# EAGLE design ldo-to-sps-patch (EAGLE 6.5.0)
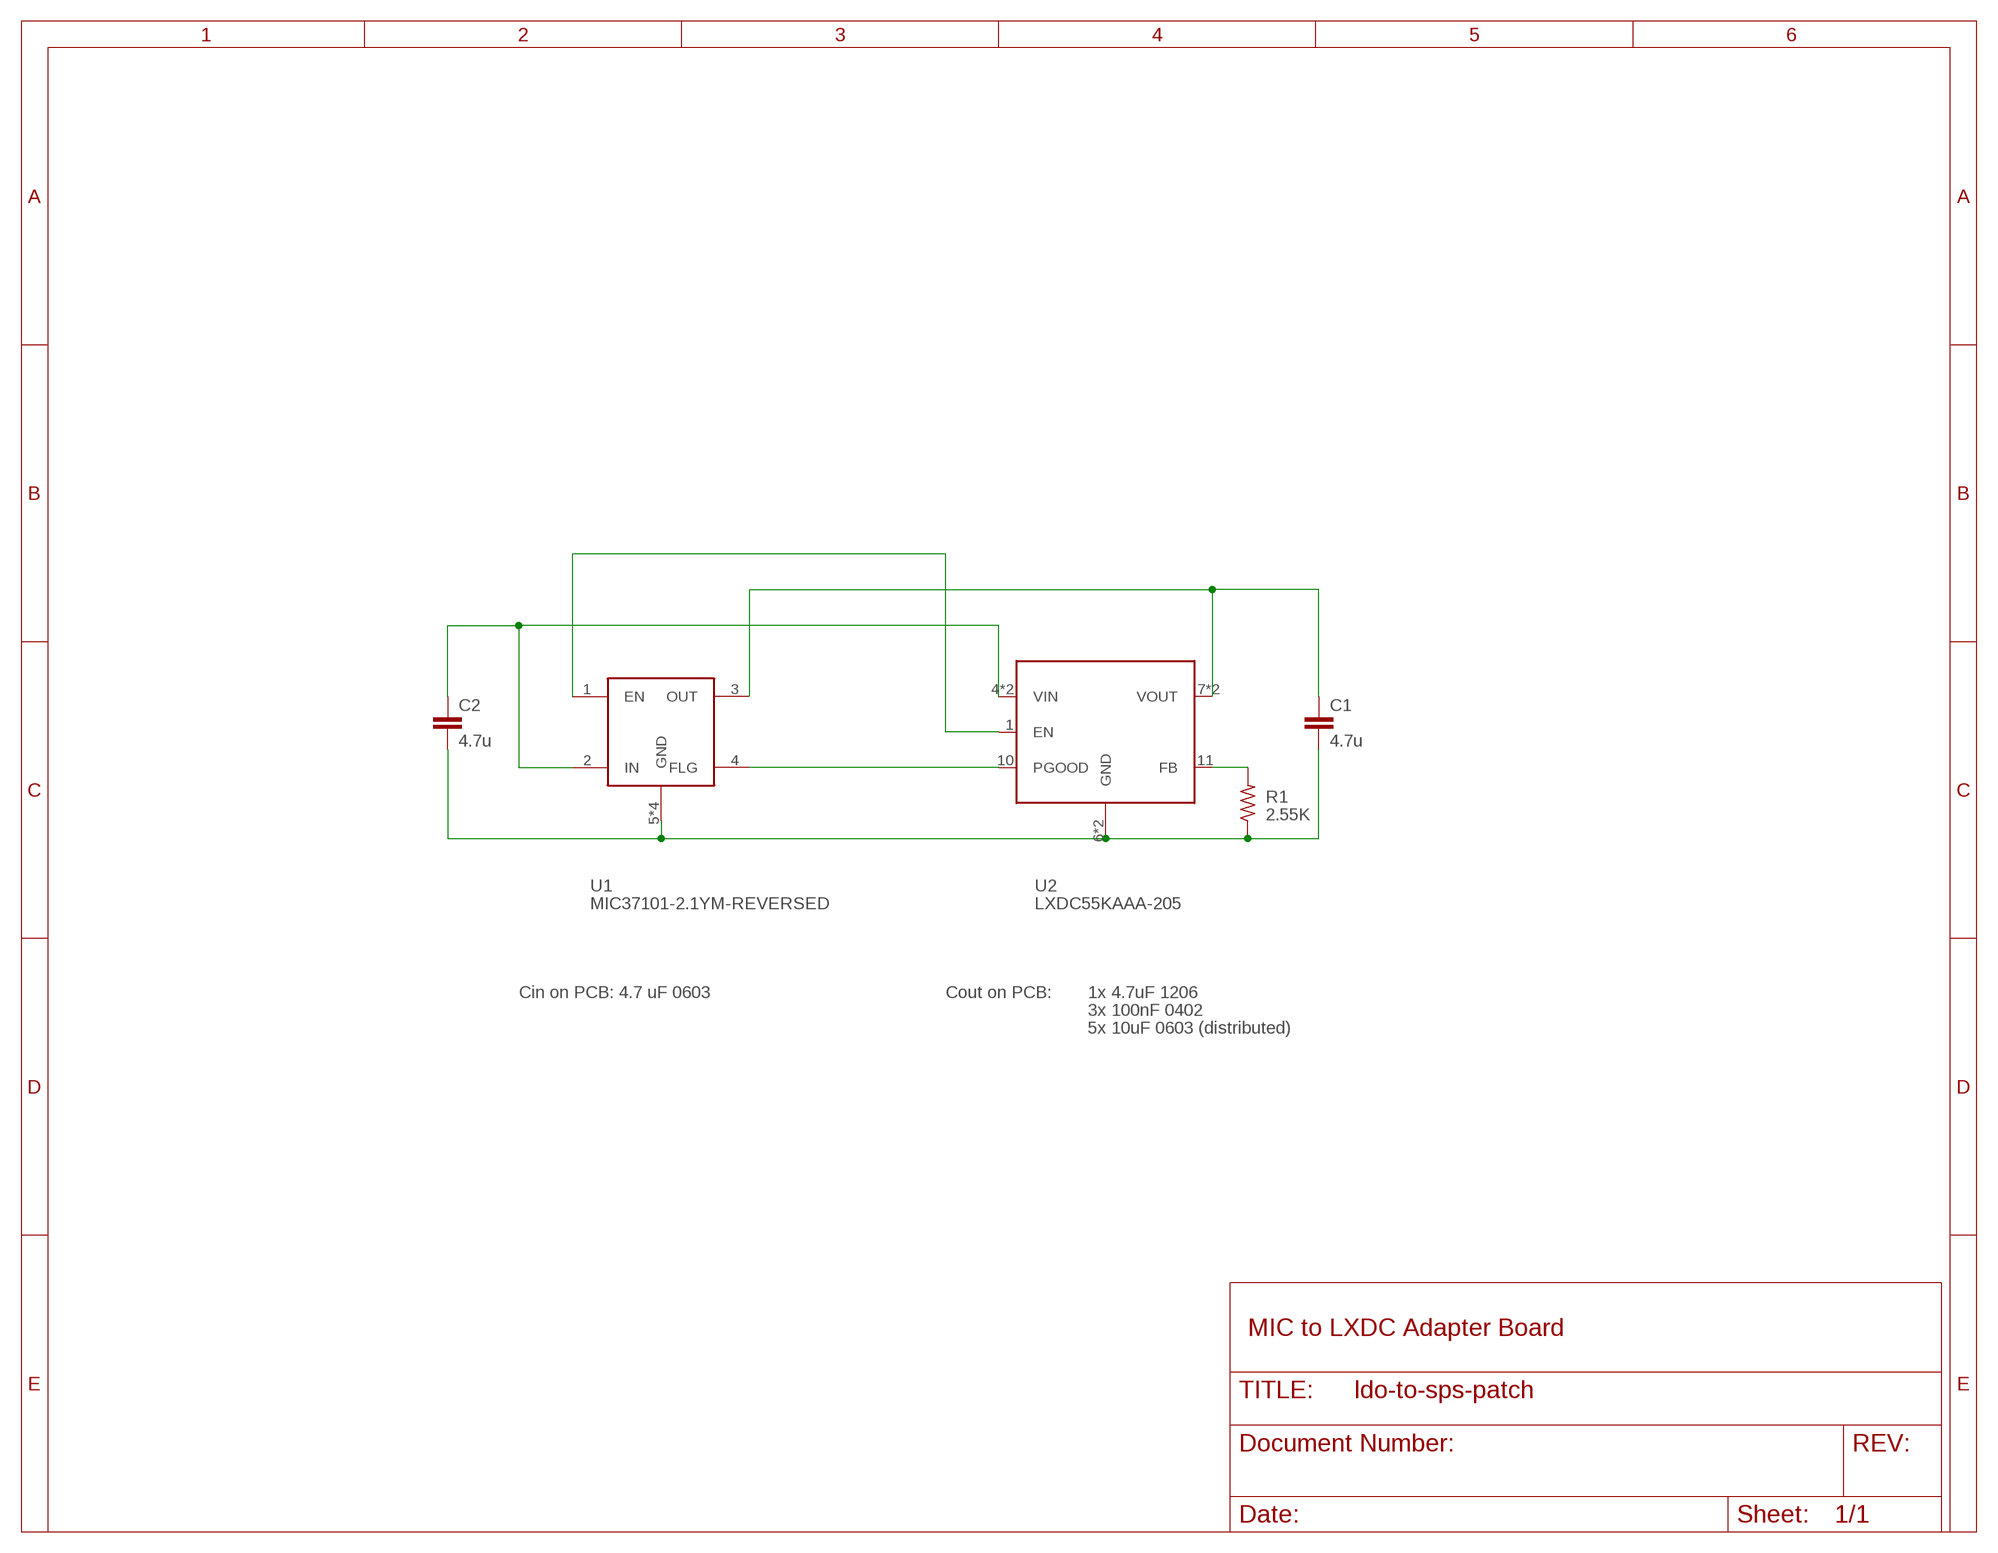
[diagram p0: schematic, sheet 1]

## Parts
C1  4.7u  C-EU0402-B-NOSILK  [0402-B-NOSILK]
C2  4.7u  C-EU0402-B-NOSILK  [0402-B-NOSILK]
R1  2.55K  R-US_0402-B-NOSILK  [0402-B-NOSILK]
U1  MIC37101-2.1YM-REVERSED  [SOIC-8-REVERSED]
U2  LXDC55KAAA-205  [LXDC55KAAA-205]

## Nets
EN: U1.1(EN) U2.1(EN)
FB: R1.2 U2.11(FB)
GND: C1.2 C2.2 R1.1 U1.5(GND) U1.6(GND) U1.7(GND) U1.8(GND) U2.6(GND) U2.12(GND)
PGOOD: U1.4(FLG) U2.10(PGOOD)
VIN: C2.1 U1.2(IN) U2.4(VIN) U2.5(VIN)
VOUT: C1.1 U1.3(OUT) U2.7(VOUT) U2.8(VOUT)

## Notes on the sheet
- Cin on PCB: 4.7 uF 0603 | Cout on PCB: | 1x 4.7uF 1206
- 3x 100nF 0402
- 5x 10uF 0603 (distributed)
- MIC to LXDC Adapter Board

## Library data of the parts
C1 C2 = rcl_custom:C-EU: CAPACITOR, European symbol
R1 = rcl_custom:R-US_: RESISTOR, American symbol
U1 = MIC37100:MIC37101-2.1YM-REVERSED
U2 = lxdc55kaaa-205:LXDC55KAAA-205

## Board
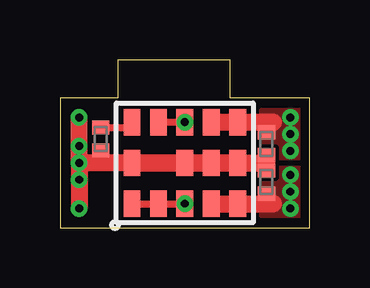
[diagram p1: board, top side]
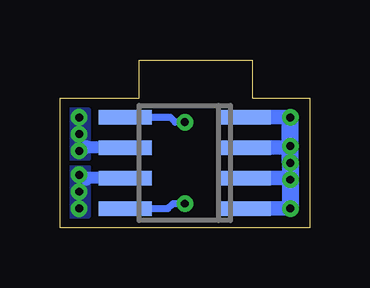
[diagram p2: board, bottom side, seen from below]

Size 10.4 x 7 mm. Coordinates in mm from the lower left corner, seen from the top.
Outline: 0,0 10.4,0 10.4,5.4 7.1,5.4 7.1,7 2.4,7 2.4,5.4 0,5.4 0,0
Copper layers (1*16): Top 0.0356mm / dielectric 1.5011mm / Bottom 0.0356mm
Design rules "osh-park-2layer *": minimum track width 6mil, minimum drill 13mil, track to track 6mil, track to pad 6mil, pad to pad 6mil, via to via 6mil, smd to smd 6mil, copper to edge 15mil, drill to drill 6mil, minimum pad ring 7mil, minimum via ring 7mil, stop-mask expansion 3mil, vias tented up to drill 16mil, thermal gap 10mil

### Footprints (pad centres in the part's own frame; a part is rotated, then mirrored left to right if it is on the bottom)
0402-B-NOSILK = smd 0.59 x 0.72: 1 -0.48,0; 2 0.48,0
SOIC-8-REVERSED = smd 0.6 x 2.2: 1 -1.905,2.48; 2 -0.635,2.48; 3 0.635,2.48; 4 1.905,2.48; 5 1.905,-2.48; 6 0.635,-2.48; 7 -0.635,-2.48; 8 -1.905,-2.48
LXDC55KAAA-205 = smd 0.7 x 1.1: 1 2.2,1.7; 2 1.1,1.7; 3 0,1.7; 4 -1.1,1.7; 5 -2.2,1.7; 6 -2.2,0; 7 -2.2,-1.7; 8 -1.1,-1.7; 9 0,-1.7; 10 1.1,-1.7; 11 2.2,-1.7; 12 2.2,0; 13 0,0; 14 -1.1,0

### Placement (x,y rotation side)
C1  8.6,3.5 270 top
C2  8.6,1.9 90 top
R1  1.7,3.7 90 top
U1  5.2,2.7 90 bottom
U2  5.2,2.7 180 top

### Tracks (layer width: path | path; a pad name or v marks a point on that pad's centre or on a via)
EN  (via drill 0.33)
  Top 0.3: U2.1 v5.2,1
  Bottom 0.3: v5.2,1 5.7,1 5.91,0.8 U1.1
FB
  Top 0.3: R1.2 2.78,4.18 U2.11
GND  (via drill 0.33)
  Top 0.3: R1.1 1.7,3 1.6,2.9 1.6,2.7 | C1.2 8.6,2.7 C2.2
  Top 0.7: U2.12 U2.6 | U2.6 1.6,2.7 v0.8,2.7 | U2.6 8.6,2.7 | v0.8,2.7 v0.8,4.6 | v0.8,2.7 v0.8,0.8
  Bottom 0.5: 0.86,3.33 v0.8,3.4
  Bottom 0.6: U1.8 v0.8,0.8 | U1.7 0.8,2.06 v0.8,2 | U1.6 0.8,3.33 v0.8,3.4 | U1.5 v0.8,4.61 v0.8,4.6
  Bottom 0.7: v0.8,4.6 v0.8,3.4 v0.8,2.7 v0.8,2 v0.8,0.8
PGOOD  (via drill 0.33)
  Top 0.3: U2.10 v5.2,4.4
  Bottom 0.3: v5.2,4.4 5.6,4.4 5.8,4.61 U1.4
VIN  (via drill 0.33)
  Top 0.7: 8.9,1 U2.5 U2.4
  Bottom 0.5: U1.2 9.3,2.06 9.3,2
  other vias: 9.6,2.2 9.6,1.5 9.6,0.8
  pour Top (no thermals): 8.4,2.5 10.1,2.5 10.1,0.5 8.4,0.5
  pour Bottom: 9.2,2.5 10,2.5 10,0.5 9.2,0.5
VOUT  (via drill 0.33)
  Top 0.7: 8.9,4.4 U2.7 U2.8
  Bottom 0.5: U1.3 9.3,3.33 9.3,3.4
  other vias: 9.6,3.2 9.6,3.9 9.6,4.6
  pour Top (isolate 0.1, no thermals): 8.4,2.9 8.4,4.9 10.1,4.9 10.1,2.9
  pour Bottom: 9.2,2.9 9.2,4.9 10,4.9 10,2.9